# Altium schematic sheet DC-DC_VCC_IN_+3V.SchDoc
size A4
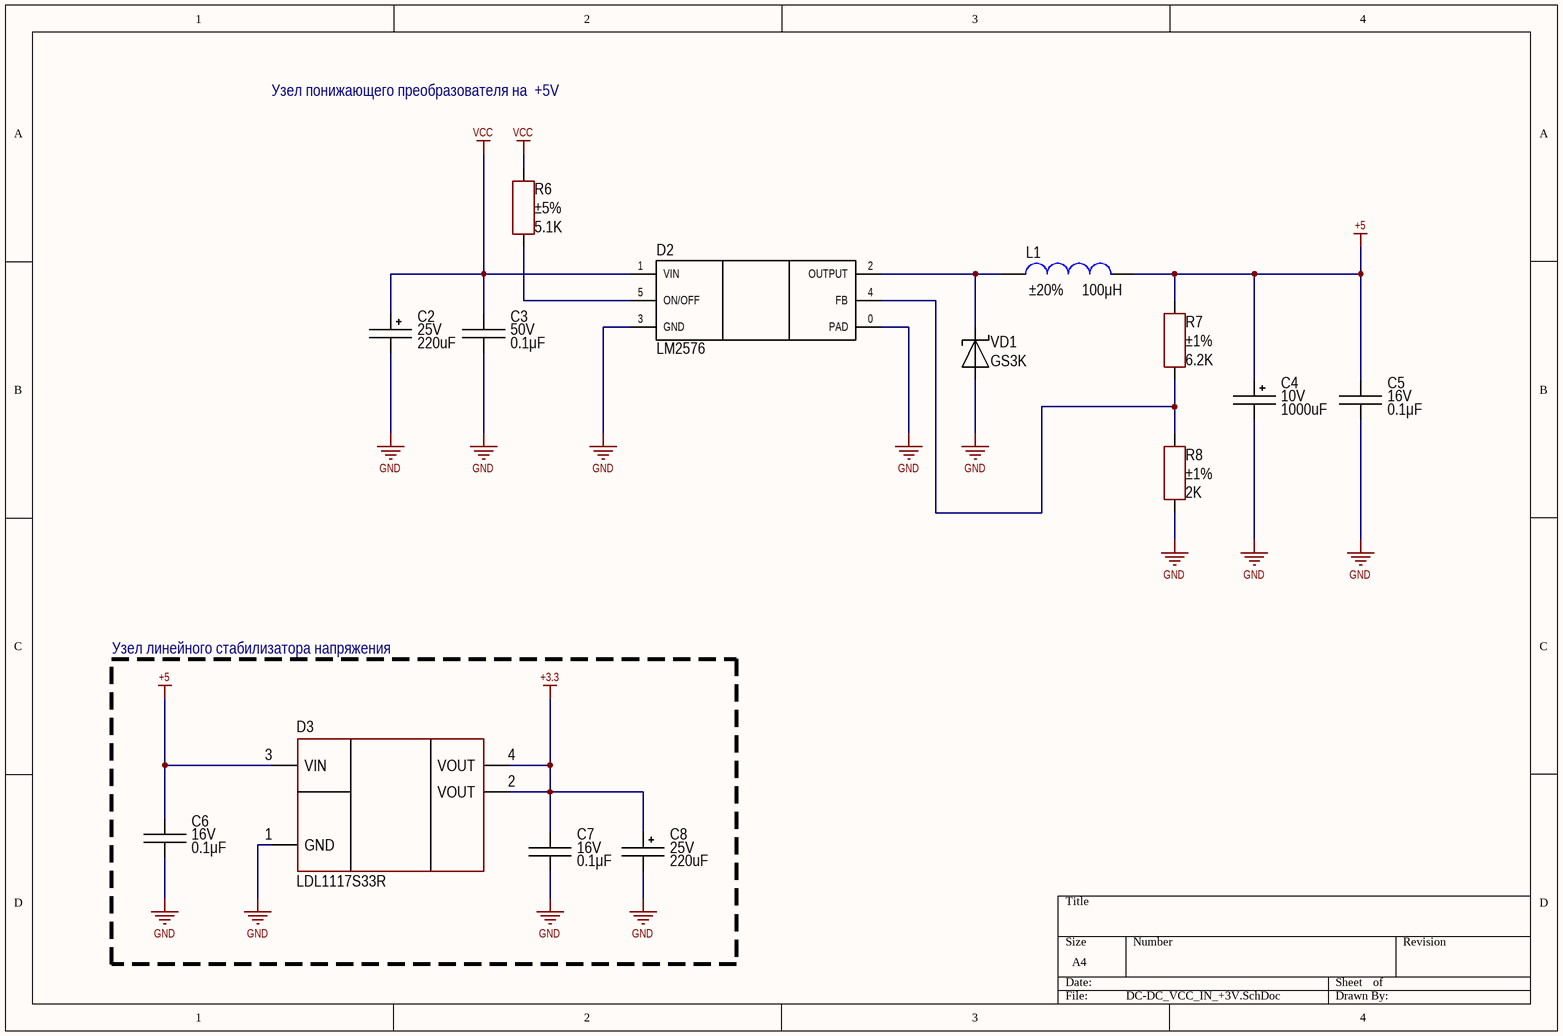
[diagram p0: DC-DC_VCC_IN_+3V.SchDoc]

## Parts
C2  value 220uF  Voltage: 25V  [CAP: D6.3C2.5H11]
C3  value 0.1μF  Voltage: 50V  [CAP: 0603]
C4  value 1000uF  Voltage: 10V  [CAP: D8C3.5H12]
C5  value 0.1μF  Voltage: 16V  [CAP: 0603]
C6  value 0.1μF  Voltage: 16V  [CAP: 0603]
C7  value 0.1μF  Voltage: 16V  [CAP: 0603]
C8  value 220uF  Voltage: 25V  [CAP: D6.3C2.5H11]
D2  (no value)  [TO-220-5]
D3  (no value)  [SOT223]
L1  value 100μH  Tolerance: ±20%  [CDRH]
R6  value 5.1K  Tolerance: ±5%  [RES: 0603]
R7  value 6.2K  Tolerance: ±1%  [RES: 0603]
R8  value 2K  Tolerance: ±1%  [RES: 0603]
VD1  PartNumber: GS3K  [DIODE: SMC]

## Blocks framed on the sheet
Узел линейного стабилизатора напряжения: C6-C8 D3

## Nets
+3.3: C7.2 C8.1 D3.2(VOUT) D3.4(VOUT)
+5: C4.1 C5.2 C6.2 D3.3(VIN) L1.1 R7.2
GND: C2.2 C3.1 C4.2 C5.1 C6.1 C7.1 C8.2 D2.0(PAD) D2.3(GND) D3.1(GND) R8.1 VD1.1
VCC: C2.1 C3.2 D2.1(VIN) R6.2
NetD2_2: D2.2(OUTPUT) L1.2 VD1.2
NetD2_4: D2.4(FB) R7.1 R8.2
NetD2_5: D2.5(ON/OFF) R6.1

## Notes on the sheet
- Узел понижающего преобразователя на  +5V

## Library data of the parts
C2 C8 = Aluminium: Manufacturer: Aishi; PartNumber: 42330; ValueManufacturerPartNumber: Aluminium capacitor, 220uF, 25V, ±20%, 54mOhm, 6.3x12, -55...+105°C; TypeCapacitor: Aluminium capacitor; Tolerance: ±20%; Impedance: 54mOhm; Package: 6.3x12; HelpURL: https://belchip.by/product/?selected_product=42330; Temperature: -55...+105°C
C3 = Ceramic_0603: Manufacturer: Yageo; PartNumber: CC0603KRX7R7BB104; ValueManufacturerPartNumber: Ceramic capacitor, 0.1μF, X7R, ±10%, 50V, 0603, -55...+125°C; TypeCapacitor: Ceramic capacitor; Tolerance: ±10%; TypeDielectric: X7R; Package: 0603; HelpURL: https://www.digikey.com/product-detail/en/yageo/CC0603KRX7R7BB104/311-1088-1-ND/302998; Temperature: -55...+125°C
C4 = Aluminium: Manufacturer: Aishi; PartNumber: 01675; ValueManufacturerPartNumber: Aluminium capacitor, 1000uF, 10V, ±20%, 54mOhm, 8x12, -55...+105°C; TypeCapacitor: Aluminium capacitor; Tolerance: ±20%; Impedance: 54mOhm; Package: 8x12; HelpURL: https://belchip.by/product/?selected_product=01675; Temperature: -55...+105°C
C5-C7 = Ceramic_0603: Manufacturer: Yageo; PartNumber: CC0603KRX7R7BB104; ValueManufacturerPartNumber: Ceramic capacitor, 0.1μF, X7R, ±10%, 16V, 0603, -55...+125°C; TypeCapacitor: Ceramic capacitor; Tolerance: ±10%; TypeDielectric: X7R; Package: 0603; HelpURL: https://www.digikey.com/product-detail/en/yageo/CC0603KRX7R7BB104/311-1088-1-ND/302998; Temperature: -55...+125°C
D2 = LM2576: Step-Down Voltage Regulator; Manufacturer: texas instruments; ValueManufacturerPartNumber: Step-Down Voltage Regulator, 7-40V, 52kHz, 1.23V to 37V, 3A, -40...+125°C, TO-220; VoltageInput: 7-40V; Frequency: 52kHz; CurrentOutput: 3A; VoltageOutput: 1.23V to 37V; HelpURL: https://www.ti.com/lit/ds/symlink/lm2576.pdf?ts=1627791238986&ref_url=https%253A%252F%252Fwww.google.com%252F; Package: TO-220; ComponentType: Step-Down Voltage Regulator; Temperature: -40...+125°C; PartNumber: LM2576
D3 = LDL1117S33R: Linear voltage regulator; Manufacturer: STMicroelectronics; ValueManufacturerPartNumber: Linear voltage regulator, input 3.9...18V, 0.6V, output 3.3V, 1.2A, -40...+85°C, SOT223; VoltageInput: input 3.9...18V; MaxDropout: 0.6V; CurrentOutput: 1.2A; VoltageOutput: output 3.3V; HelpURL: https://www.digikey.com/product-detail/en/stmicroelectronics/LDL1117S33R/497-17239-1-ND/7102079; Package: SOT223; ComponentType: Linear voltage regulator; Temperature: -40...+85°C; PartNumber: LDL1117S33R
L1 = Inductor_CDRH: Manufacturer: Bourns; ValueManufacturerPartNumber: Fixed inductor, 100μH, ±20%, CDRH101R, 3A, -40...+150°C; TypeInductor: Fixed inductor; MaxCurrent: 3A; PartNumber: CDRH; Package: CDRH101R; HelpURL: https://aliexpress.ru/item/32956142172.html?spm=a2g0s.9042311.0.0.f06533edih9Buf; Temperature: -40...+150°C
R6 = Resistor_0603: Manufacturer: Yageo; PartNumber: RC0603JR-07100RL; ValueManufacturerPartNumber: Resistor film, 5.1K, ±5%, 0603, 0.1W, -55...+125°C; TypeResistor: Resistor film; Power: 0.1W; Package: 0603; HelpURL: https://www.digikey.com/product-detail/en/yageo/RC0603JR-07100RL/311-100GRCT-ND/729644; Temperature: -55...+125°C
R7 = Resistor_0603: Manufacturer: Yageo; PartNumber: RC0603JR-07100RL; ValueManufacturerPartNumber: Resistor film, 6.2K, ±1%, 0603, 0.1W, -55...+125°C; TypeResistor: Resistor film; Power: 0.1W; Package: 0603; HelpURL: https://www.digikey.com/product-detail/en/yageo/RC0603JR-07100RL/311-100GRCT-ND/729644; Temperature: -55...+125°C
R8 = Resistor_0603: Manufacturer: Yageo; PartNumber: RC0603JR-07100RL; ValueManufacturerPartNumber: Resistor film, 2K, ±1%, 0603, 0.1W, -55...+125°C; TypeResistor: Resistor film; Power: 0.1W; Package: 0603; HelpURL: https://www.digikey.com/product-detail/en/yageo/RC0603JR-07100RL/311-100GRCT-ND/729644; Temperature: -55...+125°C
VD1 = Schottky_single: Manufacturer: Yangzhou Yangjie Electronic Technology Co., Ltd.; ValueManufacturerPartNumber: Schottky diode, 800V, 3A, 1.15V, 15pF, DO-214AB / SMC, -55...+150°C; TypeDiode: Schottky diode; Voltage: 800V; Current: 3A; VoltageDrop: 1.15V; RecoveryTime: 15pF; Package: DO-214AB / SMC; HelpURL: https://www.chipdip.by/product/gs3k; Temperature: -55...+150°C